# EAGLE design chariot-elevateur (EAGLE 9.2.2)

## Sheet 1 of 2
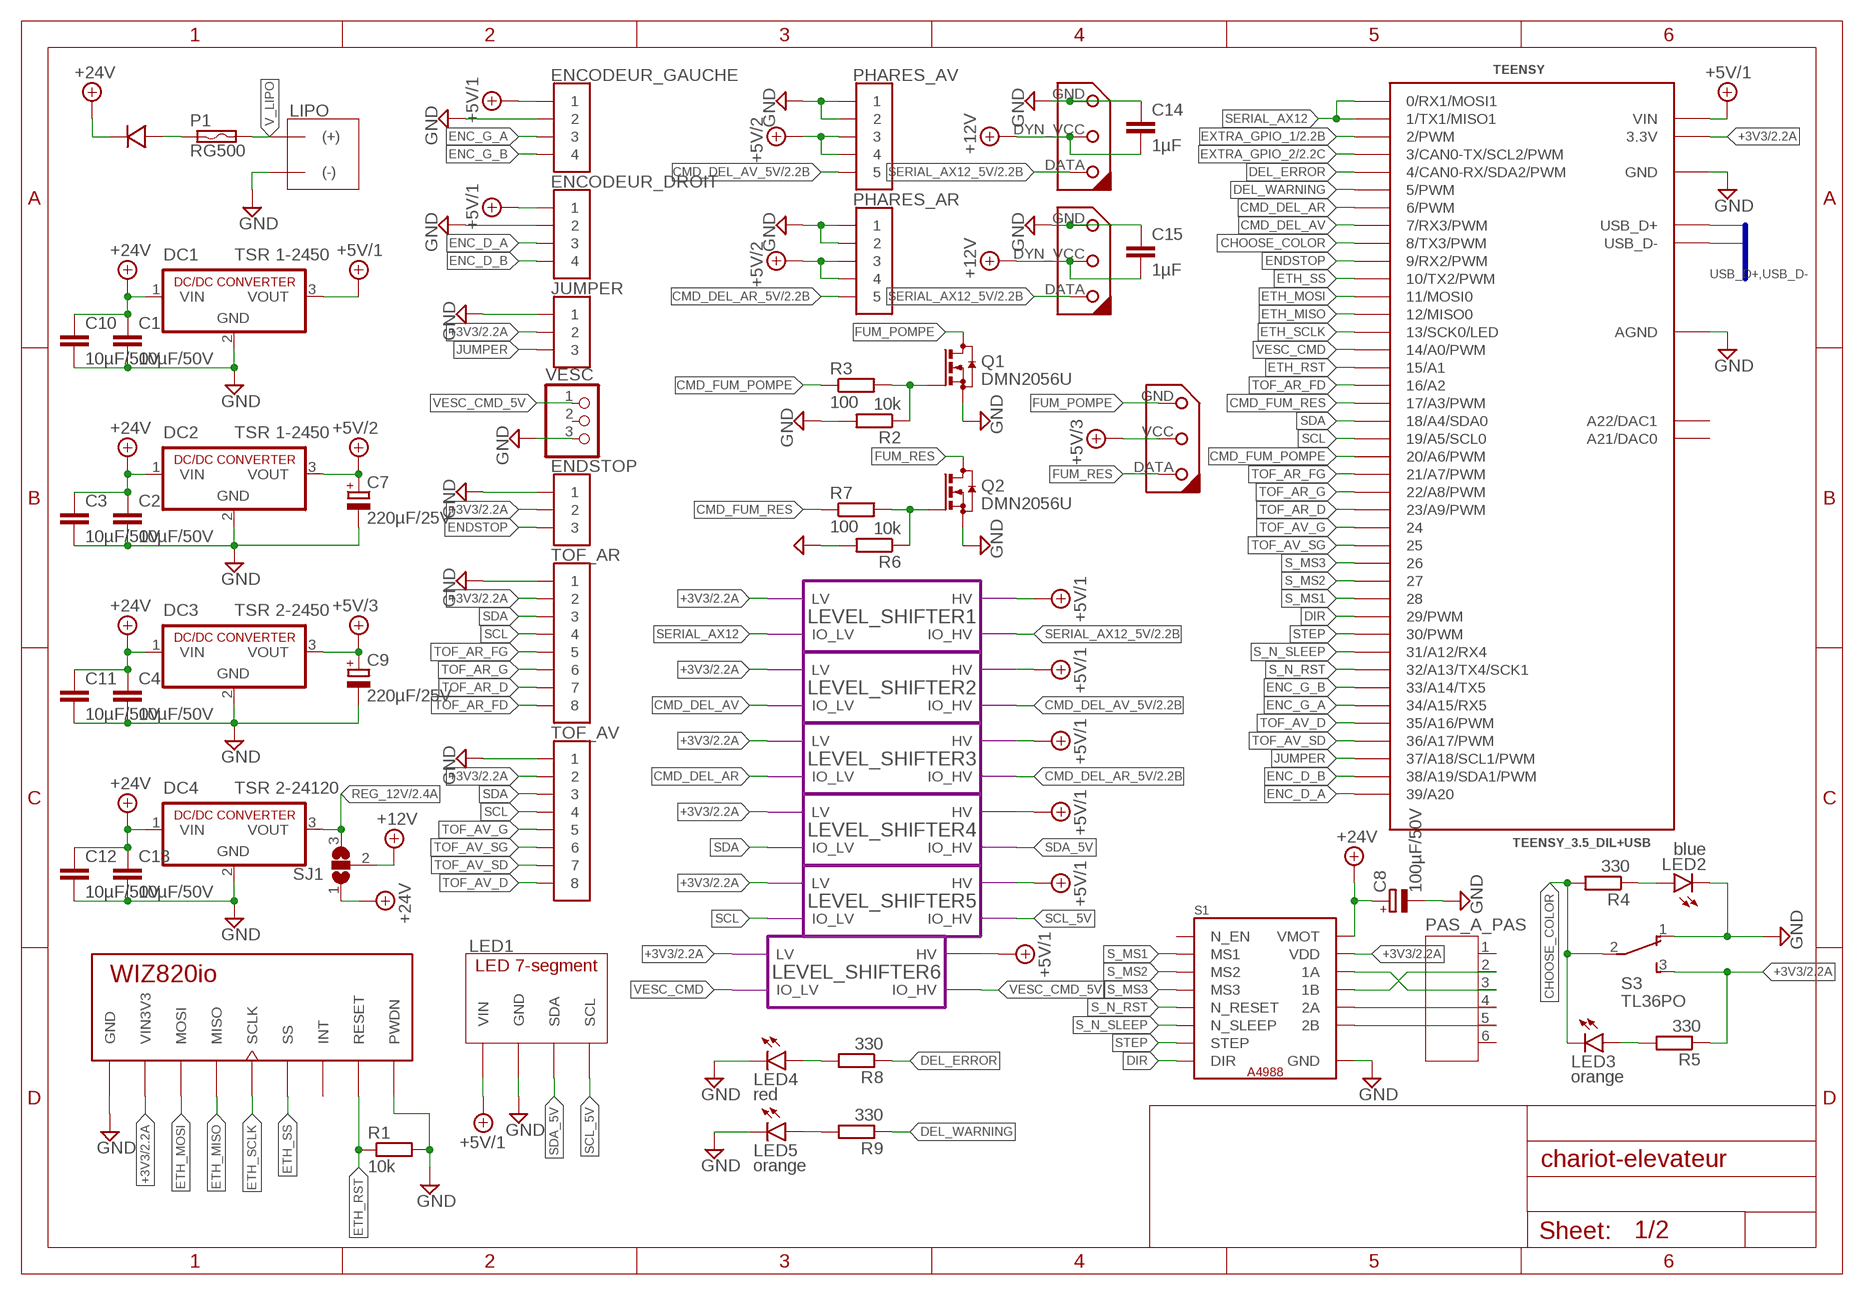
[diagram p0: schematic, sheet 1]

### Parts
AX12_AR  DYNAMIXEL-1X03AX  [DYNAMIXEL_AX_1X03]
AX12_AV  DYNAMIXEL-1X03AX  [DYNAMIXEL_AX_1X03]
C1  10µF/50V  C-EUC1210  [C1210]
C2  10µF/50V  C-EUC1210  [C1210]
C3  10µF/50V  C-EUC1210  [C1210]
C4  10µF/50V  C-EUC1210  [C1210]
C7  220µF/25V  CPOL-EUE3.5-8  [E3,5-8]
C8  100µF/50V  CPOL-EUE3.5-8  [E3,5-8]
C9  220µF/25V  CPOL-EUE3.5-8  [E3,5-8]
C10  10µF/50V  C-EUC1210  [C1210]
C11  10µF/50V  C-EUC1210  [C1210]
C12  10µF/50V  C-EUC1210  [C1210]
C13  10µF/50V  C-EUC1210  [C1210]
C14  1µF  C-EUC0805  [C0805]
C15  1µF  C-EUC0805  [C0805]
D1  DIODE_S15P45  [TO-277A]
DC1  TSR 1-2450  R-78C5.0-1.0  [SIP3]
DC2  TSR 1-2450  R-78C5.0-1.0  [SIP3]
DC3  TSR 2-2450  R-78C5.0-1.0  [SIP3]
DC4  TSR 2-24120  R-78C12-1.0  [SIP3]
ENCODEUR_DROIT  JST-04GH-V  [GH-04-V]
ENCODEUR_GAUCHE  JST-04GH-V  [GH-04-V]
ENDSTOP  JST-03  [GH-03-V]
FUMIGENE  DYNAMIXEL-1X03XL  [DYNAMIXEL_XL_1X03]
JUMPER  JST-03  [GH-03-V]
LED1  ADAFRUIT_7-SEGMENT-LED  [0.56"LED_BACKPACK]
LED2  blue  LEDSMT1206  [1206]
LED3  orange  LEDSMT1206  [1206]
LED4  red  LED3MM  [LED3MM]
LED5  orange  LED3MM  [LED3MM]
LIPO  XT-60  [XT-60]
P1  RG500  RGEF800  [5MM]
PAS_A_PAS  JST-PH6  [JST-PH6]
PHARES_AR  JST-05  [GH-05-V]
PHARES_AV  JST-05  [GH-05-V]
Q1  DMN2056U  BSS123  [SOT23]
Q2  DMN2056U  BSS123  [SOT23]
R1  10k  R-EU_R0805  [R0805]
R2  10k  R-EU_R0805  [R0805]
R3  100  R-EU_R0805  [R0805]
R4  330  R-EU_R0805  [R0805]
R5  330  R-EU_R0805  [R0805]
R6  10k  R-EU_R0805  [R0805]
R7  100  R-EU_R0805  [R0805]
R8  330  R-EU_R0805  [R0805]
R9  330  R-EU_R0805  [R0805]
S1  A4988-BREAKOUT  [A4988-BREAKOUT]
S3  TL36PO  [TL3XPO]
SJ1  SJ2W  [SJ_2]
TEENSY  TEENSY_3.5_DIL+USB  [TEENSY_3.5_DIL+USB]
TOF_AR  JST-08  [GH-08-V]
TOF_AV  JST-08  [GH-08-V]
U1  WIZ820IO  [WIZ820]
VESC  PINHD-1X3/90  [1X03/90]

### Module instances
LEVEL_SHIFTER1 = LEVEL_SHIFTER
LEVEL_SHIFTER2 = LEVEL_SHIFTER
LEVEL_SHIFTER3 = LEVEL_SHIFTER
LEVEL_SHIFTER4 = LEVEL_SHIFTER
LEVEL_SHIFTER5 = LEVEL_SHIFTER
LEVEL_SHIFTER6 = LEVEL_SHIFTER

### Nets
+3V3 [1A]: ENDSTOP.2 JUMPER.2 R5.1 S1.VDD S3.3(S) TEENSY.3.3V TEENSY.3.3V3(3.3V) TOF_AR.2 TOF_AV.2 U1.VIN1(VIN3V3) U1.VIN2(VIN3V3) ; port LEVEL_SHIFTER1.LV LEVEL_SHIFTER2.LV LEVEL_SHIFTER3.LV LEVEL_SHIFTER4.LV LEVEL_SHIFTER5.LV LEVEL_SHIFTER6.LV ; also sheet 2
+5V/1 [1A]: DC1.3(VOUT) ENCODEUR_DROIT.1 ENCODEUR_GAUCHE.1 LED1.VCC(VIN) TEENSY.VIN ; port LEVEL_SHIFTER1.HV LEVEL_SHIFTER4.HV LEVEL_SHIFTER5.HV LEVEL_SHIFTER6.HV LEVEL_SHIFTER2.HV LEVEL_SHIFTER3.HV ; also sheet 2
+5V/2 [2A]: C7.+ DC2.3(VOUT) PHARES_AR.3 PHARES_AR.4 PHARES_AV.3 PHARES_AV.4 ; also sheet 2
+5V/3 [2A]: C9.+ DC3.3(VOUT) FUMIGENE.VCC(DYN_VCC) ; also sheet 2
+12V [2A]: AX12_AR.DYN_VCC AX12_AV.DYN_VCC C14.2 C15.2 SJ1.2 ; also sheet 2
+24V [1A]: C1.1 C2.1 C3.1 C4.1 C8.+ C10.1 C11.1 C12.1 C13.1 D1.- DC1.1(VIN) DC2.1(VIN) DC3.1(VIN) DC4.1(VIN) S1.VMOT SJ1.1 ; also sheet 2
CHOOSE_COLOR: LED3.C R4.2 S3.2(P) TEENSY.8(8/TX3/PWM)
CMD_DEL_AR: TEENSY.6(6/PWM) ; port LEVEL_SHIFTER3.IO_LV
CMD_DEL_AR_5V: PHARES_AR.5 ; port LEVEL_SHIFTER3.IO_HV ; also sheet 2
CMD_DEL_AV: TEENSY.7(7/RX3/PWM) ; port LEVEL_SHIFTER2.IO_LV
CMD_DEL_AV_5V: PHARES_AV.5 ; port LEVEL_SHIFTER2.IO_HV ; also sheet 2
CMD_FUM_POMPE: R3.1 TEENSY.20/A6(20/A6/PWM)
CMD_FUM_RES: R7.1 TEENSY.17/A3(17/A3/PWM)
DEL_ERROR: R8.1 TEENSY.4(4/CAN0-RX/SDA2/PWM)
DEL_WARNING: R9.1 TEENSY.5(5/PWM)
DIR: S1.DIR TEENSY.29(29/PWM)
ENC_D_A: ENCODEUR_DROIT.3 TEENSY.39/A20
ENC_D_B: ENCODEUR_DROIT.4 TEENSY.38/A19(38/A19/SDA1/PWM)
ENC_G_A: ENCODEUR_GAUCHE.3 TEENSY.34/A15(34/A15/RX5)
ENC_G_B: ENCODEUR_GAUCHE.4 TEENSY.33/A14(33/A14/TX5)
ENDSTOP: ENDSTOP.3 TEENSY.9(9/RX2/PWM)
ETH_MISO: TEENSY.12(12/MISO0) U1.MISO
ETH_MOSI: TEENSY.11(11/MOSI0) U1.MOSI
ETH_RST: R1.1 TEENSY.15/A1 U1.RESET
ETH_SCLK: TEENSY.13(13/SCK0/LED) U1.SCLK
ETH_SS: TEENSY.10(10/TX2/PWM) U1.SS
EXTRA_GPIO_1: TEENSY.2(2/PWM) ; also sheet 2
EXTRA_GPIO_2: TEENSY.3(3/CAN0-TX/SCL2/PWM) ; also sheet 2
FUM_POMPE [2A]: FUMIGENE.GND Q1.3(D)
FUM_RES [2A]: FUMIGENE.DATA Q2.3(D)
GND: AX12_AR.GND AX12_AV.GND C1.2 C2.2 C3.2 C4.2 C7.- C8.- C9.- C10.2 C11.2 C12.2 C13.2 C14.1 C15.1 DC1.2(GND) DC2.2(GND) DC3.2(GND) DC4.2(GND) ENCODEUR_DROIT.2 ENCODEUR_GAUCHE.2 ENDSTOP.1 JUMPER.1 LED1.GND LED2.C LED4.K(C) LED5.K(C) LIPO.(-) PHARES_AR.1 PHARES_AR.2 PHARES_AV.1 PHARES_AV.2 Q1.2(S) Q2.2(S) R1.2 R2.2 R6.2 S1.GND1(GND) S1.GND2(GND) S3.1(O) TEENSY.AGND TEENSY.GND TEENSY.GND1(GND) TOF_AR.1 TOF_AV.1 U1.GND1(GND) U1.GND2(GND) U1.GND3(GND) U1.PWDN VESC.3 ; also sheet 2
JUMPER: JUMPER.3 TEENSY.37/A18(37/A18/SCL1/PWM)
N$1: LED4.A R8.2
N$2 [2A]: PAS_A_PAS.2 S1.1B
N$3 [2A]: PAS_A_PAS.3 S1.1A
N$4: D1.+1(+) D1.+2(+) P1.P$1
N$5 [2A]: PAS_A_PAS.4 S1.2A
N$6 [2A]: PAS_A_PAS.5 S1.2B
N$7: LED2.A R4.1
N$8: LED3.A R5.2
N$10: Q1.1(G) R2.1 R3.2
N$11: LED5.A R9.2
N$13: Q2.1(G) R6.1 R7.2
REG_12V [2A]: DC4.3(VOUT) SJ1.3 ; also sheet 2
S_MS1: S1.MS1 TEENSY.28
S_MS2: S1.MS2 TEENSY.27
S_MS3: S1.MS3 TEENSY.26
S_N_RST: S1.N_RST(N_RESET) TEENSY.32/A13(32/A13/TX4/SCK1)
S_N_SLEEP: S1.N_SLEEP TEENSY.31/A12(31/A12/RX4)
SCL: TEENSY.19/A5(19/A5/SCL0) TOF_AR.4 TOF_AV.4 ; port LEVEL_SHIFTER5.IO_LV
SCL_5V: LED1.SCL ; port LEVEL_SHIFTER5.IO_HV
SDA: TEENSY.18/A4(18/A4/SDA0) TOF_AR.3 TOF_AV.3 ; port LEVEL_SHIFTER4.IO_LV
SDA_5V: LED1.SDA ; port LEVEL_SHIFTER4.IO_HV
SERIAL_AX12: TEENSY.0(0/RX1/MOSI1) TEENSY.1(1/TX1/MISO1) ; port LEVEL_SHIFTER1.IO_LV
SERIAL_AX12_5V: AX12_AR.DATA AX12_AV.DATA ; port LEVEL_SHIFTER1.IO_HV ; also sheet 2
STEP: S1.STEP TEENSY.30(30/PWM)
TOF_AR_D: TEENSY.23/A9(23/A9/PWM) TOF_AR.7
TOF_AR_FD: TEENSY.16/A2 TOF_AR.8
TOF_AR_FG: TEENSY.21/A7(21/A7/PWM) TOF_AR.5
TOF_AR_G: TEENSY.22/A8(22/A8/PWM) TOF_AR.6
TOF_AV_D: TEENSY.35/A16(35/A16/PWM) TOF_AV.8
TOF_AV_G: TEENSY.24 TOF_AV.5
TOF_AV_SD: TEENSY.36/A17(36/A17/PWM) TOF_AV.7
TOF_AV_SG: TEENSY.25 TOF_AV.6
USB_D+: TEENSY.USBD+(USB_D+) ; also sheet 2
USB_D-: TEENSY.USBD-(USB_D-) ; also sheet 2
V_LIPO [5A]: LIPO.(+) P1.P$2
VESC_CMD: TEENSY.14/A0(14/A0/PWM) ; port LEVEL_SHIFTER6.IO_LV
VESC_CMD_5V: VESC.1 ; port LEVEL_SHIFTER6.IO_HV
Unconnected: PAS_A_PAS.1 PAS_A_PAS.6 S1.N_EN TEENSY.A21(A21/DAC0) TEENSY.A22(A22/DAC1) U1.INT VESC.2

### Buses
USB_D+,USB_D-

## Sheet 2 of 2
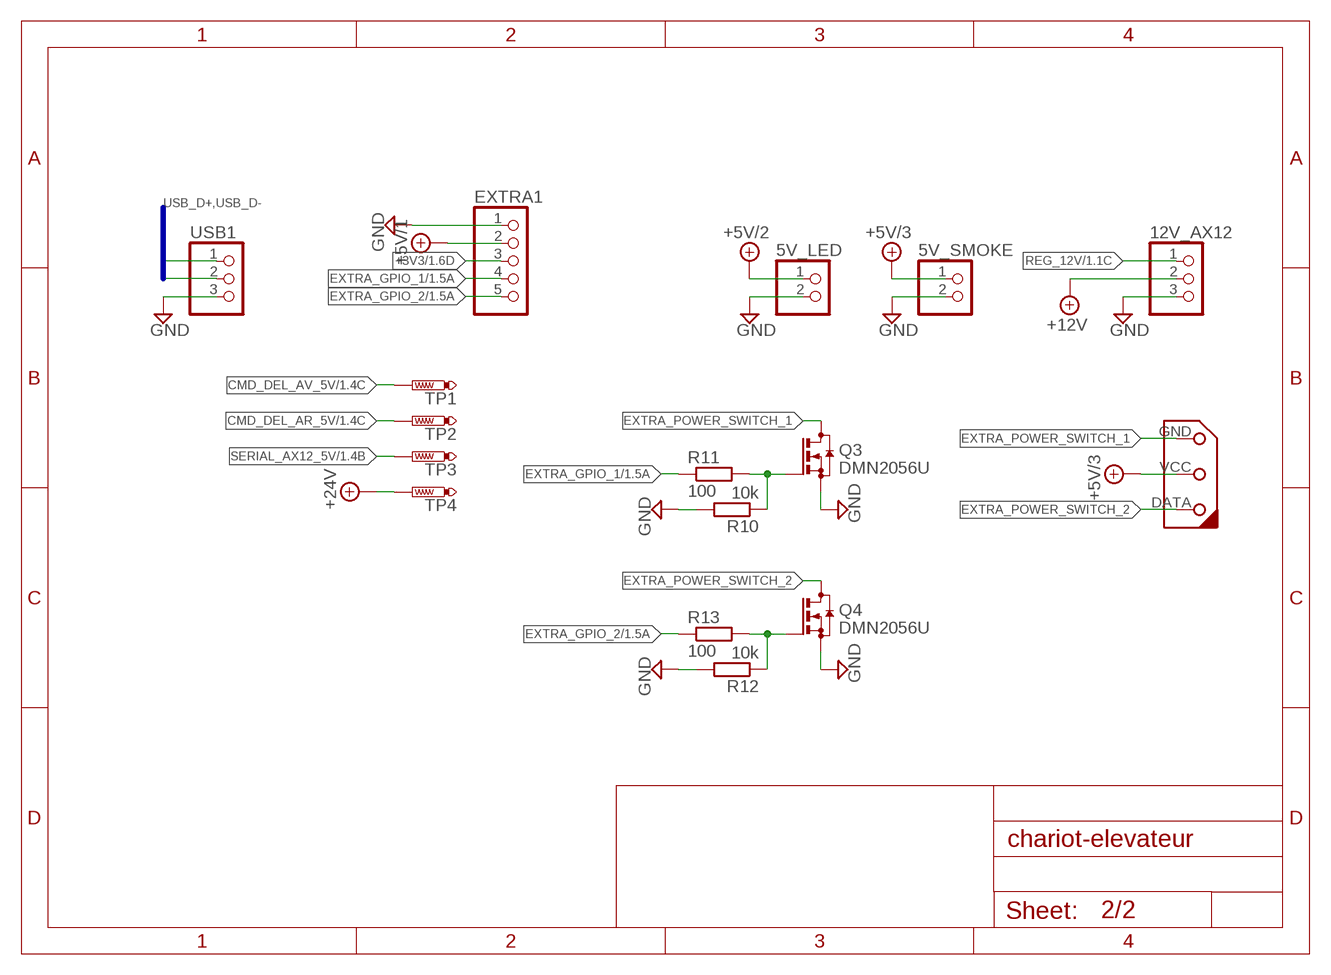
[diagram p1: schematic, sheet 2]

### Parts
5V_LED  PINHD-1X2  [1X02]
5V_SMOKE  PINHD-1X2  [1X02]
12V_AX12  PINHD-1X3  [1X03]
EXTRA  DYNAMIXEL-1X03XL  [DYNAMIXEL_XL_1X03]
EXTRA1  PINHD-1X5  [1X05]
Q3  DMN2056U  BSS123  [SOT23]
Q4  DMN2056U  BSS123  [SOT23]
R10  10k  R-EU_R0805  [R0805]
R11  100  R-EU_R0805  [R0805]
R12  10k  R-EU_R0805  [R0805]
R13  100  R-EU_R0805  [R0805]
TP1  PTR1PAD1-13  [P1-13]
TP2  PTR1PAD1-13  [P1-13]
TP3  PTR1PAD1-13  [P1-13]
TP4  PTR1PAD1-13  [P1-13]
USB1  PINHD-1X3  [1X03]

### Nets
+3V3 [1A]: EXTRA1.3 ; also sheet 1
+5V/1 [1A]: EXTRA1.2 ; also sheet 1
+5V/2 [2A]: 5V_LED.1 ; also sheet 1
+5V/3 [2A]: 5V_SMOKE.1 EXTRA.VCC(DYN_VCC) ; also sheet 1
+12V [2A]: 12V_AX12.2 ; also sheet 1
+24V [1A]: TP4.TP ; also sheet 1
CMD_DEL_AR_5V: TP2.TP ; also sheet 1
CMD_DEL_AV_5V: TP1.TP ; also sheet 1
EXTRA_GPIO_1: EXTRA1.4 R11.1 ; also sheet 1
EXTRA_GPIO_2: EXTRA1.5 R13.1 ; also sheet 1
EXTRA_POWER_SWITCH_1 [2A]: EXTRA.GND Q3.3(D)
EXTRA_POWER_SWITCH_2 [2A]: EXTRA.DATA Q4.3(D)
GND: 5V_LED.2 5V_SMOKE.2 12V_AX12.3 EXTRA1.1 Q3.2(S) Q4.2(S) R10.2 R12.2 USB1.3 ; also sheet 1
N$9: Q3.1(G) R10.1 R11.2
N$12: Q4.1(G) R12.1 R13.2
REG_12V [2A]: 12V_AX12.1 ; also sheet 1
SERIAL_AX12_5V: TP3.TP ; also sheet 1
USB_D+: USB1.1 ; also sheet 1
USB_D-: USB1.2 ; also sheet 1

### Buses
USB_D+,USB_D-

## Library data of the parts
5V_LED 5V_SMOKE = pinhead:PINHD-1X2: PIN HEADER
12V_AX12 USB1 VESC = pinhead:PINHD-1X3: PIN HEADER
AX12_AR AX12_AV = 1NTech_pinhead:DYNAMIXEL-1X03; RS: 687-8124; RS_AX: 687-8124; RS_XL: 688-3283
C1-C4 C10-C15 = resistor:C-EU: CAPACITOR, European symbol
C7-C9 = resistor:CPOL-EU: POLARIZED CAPACITOR, European symbol
D1 = diode_schottky:DIODE_S15P45; RS: 917-9118
DC1 DC2 = dc-dc-converter:R-78C*-1.0: INNOLINE DC/DC-Converter 1.0 AMP SIP3 Single Output Source: Data sheet <http://www.mikrocontroller.net/attachment/150645/157764-da-01-en-DC_DC_WANDLER_R_78C5_0_1_0.pdf>; RS: 666-4379
DC3 = dc-dc-converter:R-78C*-1.0: INNOLINE DC/DC-Converter 1.0 AMP SIP3 Single Output Source: Data sheet <http://www.mikrocontroller.net/attachment/150645/157764-da-01-en-DC_DC_WANDLER_R_78C5_0_1_0.pdf>; RS: 906-8487
DC4 = dc-dc-converter:R-78C*-1.0: INNOLINE DC/DC-Converter 1.0 AMP SIP3 Single Output Source: Data sheet <http://www.mikrocontroller.net/attachment/150645/157764-da-01-en-DC_DC_WANDLER_R_78C5_0_1_0.pdf>; RS: 906-8493
ENCODEUR_DROIT ENCODEUR_GAUCHE = con-jst:JST-04; RS: 752-1769; RS_F: 752-1731
ENDSTOP JUMPER = con-jst:JST-03; RS: 752-1765; RS_F: 752-1737
EXTRA FUMIGENE = 1NTech_pinhead:DYNAMIXEL-1X03; RS: 688-3283
EXTRA1 = pinhead:PINHD-1X5: PIN HEADER
LED1 = Adafruit-7-segment:ADAFRUIT_7-SEGMENT-LED; ADAFRUIT: 879
LED2 = led:LED: LED OSRAM: - CHIPLED LG R971, LG N971, LY N971, LG Q971, LY Q971, LO R971, LY R971 LH N974, LH R974 LS Q976, LO Q976, LY Q976 LO Q996 - Hyper CHIPLED LW Q18S LB Q993, LB Q99A, LB R99A - SideLED LS A670, LO A670, LY A670, LG A670, LP A670 LB A673, LV A673, LT A673, LW A673 LH A674 LY A675 LS A676, LA A676, LO A676, LY A676, LW A676 LS A679, LY A679, LG A679 - Hyper Micro SIDELED® LS Y876, LA Y876, LO Y876, LY Y876 LT Y87S - SmartLED LW L88C, LW L88S LB L89C, LB L89S, LG L890 LS L89K, LO L89K, LY L89K LS L896, LA L896, LO L896, LY L896 - TOPLED LS T670, LO T670, LY T670, LG T670, LP T670 LSG T670, LSP T670, LSY T670, LOP T670, LYG T670 LG T671, LOG T671, LSG T671 LB T673, LV T673, LT T673, LW T673 LH T674 LS T676, LA T676, LO T676, LY T676, LB T676, LH T676, LSB T676, LW T676 LB T67C, LV T67C, LT T67C, LS T67K, LO T67K, LY T67K, LW E67C LS E67B, LA E67B, LO E67B, LY E67B, LB E67C, LV E67C, LT E67C LW T67C LS T679, LY T679, LG T679 LS T770, LO T770, LY T770, LG T770, LP T770 LB T773, LV T773, LT T773, LW T773 LH T774 LS E675, LA E675, LY E675, LS T675 LS T776, LA T776, LO T776, LY T776, LB T776 LHGB T686 LT T68C, LB T68C - Hyper Mini TOPLED® LB M676 - Mini TOPLED Santana® LG M470 LS M47K, LO M47K, LY M47K Source: http://www.osram.convergy.de LUXEON: - LUMILED® LXK2-PW12-R00, LXK2-PW12-S00, LXK2-PW14-U00, LXK2-PW14-V00 LXK2-PM12-R00, LXK2-PM12-S00, LXK2-PM14-U00 LXK2-PE12-Q00, LXK2-PE12-R00, LXK2-PE12-S00, LXK2-PE14-T00, LXK2-PE14-U00 LXK2-PB12-K00, LXK2-PB12-L00, LXK2-PB12-M00, LXK2-PB14-N00, LXK2-PB14-P00, LXK2-PB14-Q00 LXK2-PR12-L00, LXK2-PR12-M00, LXK2-PR14-Q00, LXK2-PR14-R00 LXK2-PD12-Q00, LXK2-PD12-R00, LXK2-PD12-S00 LXK2-PH12-R00, LXK2-PH12-S00 LXK2-PL12-P00, LXK2-PL12-Q00, LXK2-PL12-R00 Source: www.luxeon.com KINGBRIGHT: KA-3528ASYC Source: www.kingbright.com; RS: 692-1073
LED3 = led:LED: LED OSRAM: - CHIPLED LG R971, LG N971, LY N971, LG Q971, LY Q971, LO R971, LY R971 LH N974, LH R974 LS Q976, LO Q976, LY Q976 LO Q996 - Hyper CHIPLED LW Q18S LB Q993, LB Q99A, LB R99A - SideLED LS A670, LO A670, LY A670, LG A670, LP A670 LB A673, LV A673, LT A673, LW A673 LH A674 LY A675 LS A676, LA A676, LO A676, LY A676, LW A676 LS A679, LY A679, LG A679 - Hyper Micro SIDELED® LS Y876, LA Y876, LO Y876, LY Y876 LT Y87S - SmartLED LW L88C, LW L88S LB L89C, LB L89S, LG L890 LS L89K, LO L89K, LY L89K LS L896, LA L896, LO L896, LY L896 - TOPLED LS T670, LO T670, LY T670, LG T670, LP T670 LSG T670, LSP T670, LSY T670, LOP T670, LYG T670 LG T671, LOG T671, LSG T671 LB T673, LV T673, LT T673, LW T673 LH T674 LS T676, LA T676, LO T676, LY T676, LB T676, LH T676, LSB T676, LW T676 LB T67C, LV T67C, LT T67C, LS T67K, LO T67K, LY T67K, LW E67C LS E67B, LA E67B, LO E67B, LY E67B, LB E67C, LV E67C, LT E67C LW T67C LS T679, LY T679, LG T679 LS T770, LO T770, LY T770, LG T770, LP T770 LB T773, LV T773, LT T773, LW T773 LH T774 LS E675, LA E675, LY E675, LS T675 LS T776, LA T776, LO T776, LY T776, LB T776 LHGB T686 LT T68C, LB T68C - Hyper Mini TOPLED® LB M676 - Mini TOPLED Santana® LG M470 LS M47K, LO M47K, LY M47K Source: http://www.osram.convergy.de LUXEON: - LUMILED® LXK2-PW12-R00, LXK2-PW12-S00, LXK2-PW14-U00, LXK2-PW14-V00 LXK2-PM12-R00, LXK2-PM12-S00, LXK2-PM14-U00 LXK2-PE12-Q00, LXK2-PE12-R00, LXK2-PE12-S00, LXK2-PE14-T00, LXK2-PE14-U00 LXK2-PB12-K00, LXK2-PB12-L00, LXK2-PB12-M00, LXK2-PB14-N00, LXK2-PB14-P00, LXK2-PB14-Q00 LXK2-PR12-L00, LXK2-PR12-M00, LXK2-PR14-Q00, LXK2-PR14-R00 LXK2-PD12-Q00, LXK2-PD12-R00, LXK2-PD12-S00 LXK2-PH12-R00, LXK2-PH12-S00 LXK2-PL12-P00, LXK2-PL12-Q00, LXK2-PL12-R00 Source: www.luxeon.com KINGBRIGHT: KA-3528ASYC Source: www.kingbright.com; RS: 726-9215
LED4 = led:LED: LED OSRAM: - CHIPLED LG R971, LG N971, LY N971, LG Q971, LY Q971, LO R971, LY R971 LH N974, LH R974 LS Q976, LO Q976, LY Q976 LO Q996 - Hyper CHIPLED LW Q18S LB Q993, LB Q99A, LB R99A - SideLED LS A670, LO A670, LY A670, LG A670, LP A670 LB A673, LV A673, LT A673, LW A673 LH A674 LY A675 LS A676, LA A676, LO A676, LY A676, LW A676 LS A679, LY A679, LG A679 - Hyper Micro SIDELED® LS Y876, LA Y876, LO Y876, LY Y876 LT Y87S - SmartLED LW L88C, LW L88S LB L89C, LB L89S, LG L890 LS L89K, LO L89K, LY L89K LS L896, LA L896, LO L896, LY L896 - TOPLED LS T670, LO T670, LY T670, LG T670, LP T670 LSG T670, LSP T670, LSY T670, LOP T670, LYG T670 LG T671, LOG T671, LSG T671 LB T673, LV T673, LT T673, LW T673 LH T674 LS T676, LA T676, LO T676, LY T676, LB T676, LH T676, LSB T676, LW T676 LB T67C, LV T67C, LT T67C, LS T67K, LO T67K, LY T67K, LW E67C LS E67B, LA E67B, LO E67B, LY E67B, LB E67C, LV E67C, LT E67C LW T67C LS T679, LY T679, LG T679 LS T770, LO T770, LY T770, LG T770, LP T770 LB T773, LV T773, LT T773, LW T773 LH T774 LS E675, LA E675, LY E675, LS T675 LS T776, LA T776, LO T776, LY T776, LB T776 LHGB T686 LT T68C, LB T68C - Hyper Mini TOPLED® LB M676 - Mini TOPLED Santana® LG M470 LS M47K, LO M47K, LY M47K Source: http://www.osram.convergy.de LUXEON: - LUMILED® LXK2-PW12-R00, LXK2-PW12-S00, LXK2-PW14-U00, LXK2-PW14-V00 LXK2-PM12-R00, LXK2-PM12-S00, LXK2-PM14-U00 LXK2-PE12-Q00, LXK2-PE12-R00, LXK2-PE12-S00, LXK2-PE14-T00, LXK2-PE14-U00 LXK2-PB12-K00, LXK2-PB12-L00, LXK2-PB12-M00, LXK2-PB14-N00, LXK2-PB14-P00, LXK2-PB14-Q00 LXK2-PR12-L00, LXK2-PR12-M00, LXK2-PR14-Q00, LXK2-PR14-R00 LXK2-PD12-Q00, LXK2-PD12-R00, LXK2-PD12-S00 LXK2-PH12-R00, LXK2-PH12-S00 LXK2-PL12-P00, LXK2-PL12-Q00, LXK2-PL12-R00 Source: www.luxeon.com KINGBRIGHT: KA-3528ASYC Source: www.kingbright.com; RS: 619-4886
LED5 = led:LED: LED OSRAM: - CHIPLED LG R971, LG N971, LY N971, LG Q971, LY Q971, LO R971, LY R971 LH N974, LH R974 LS Q976, LO Q976, LY Q976 LO Q996 - Hyper CHIPLED LW Q18S LB Q993, LB Q99A, LB R99A - SideLED LS A670, LO A670, LY A670, LG A670, LP A670 LB A673, LV A673, LT A673, LW A673 LH A674 LY A675 LS A676, LA A676, LO A676, LY A676, LW A676 LS A679, LY A679, LG A679 - Hyper Micro SIDELED® LS Y876, LA Y876, LO Y876, LY Y876 LT Y87S - SmartLED LW L88C, LW L88S LB L89C, LB L89S, LG L890 LS L89K, LO L89K, LY L89K LS L896, LA L896, LO L896, LY L896 - TOPLED LS T670, LO T670, LY T670, LG T670, LP T670 LSG T670, LSP T670, LSY T670, LOP T670, LYG T670 LG T671, LOG T671, LSG T671 LB T673, LV T673, LT T673, LW T673 LH T674 LS T676, LA T676, LO T676, LY T676, LB T676, LH T676, LSB T676, LW T676 LB T67C, LV T67C, LT T67C, LS T67K, LO T67K, LY T67K, LW E67C LS E67B, LA E67B, LO E67B, LY E67B, LB E67C, LV E67C, LT E67C LW T67C LS T679, LY T679, LG T679 LS T770, LO T770, LY T770, LG T770, LP T770 LB T773, LV T773, LT T773, LW T773 LH T774 LS E675, LA E675, LY E675, LS T675 LS T776, LA T776, LO T776, LY T776, LB T776 LHGB T686 LT T68C, LB T68C - Hyper Mini TOPLED® LB M676 - Mini TOPLED Santana® LG M470 LS M47K, LO M47K, LY M47K Source: http://www.osram.convergy.de LUXEON: - LUMILED® LXK2-PW12-R00, LXK2-PW12-S00, LXK2-PW14-U00, LXK2-PW14-V00 LXK2-PM12-R00, LXK2-PM12-S00, LXK2-PM14-U00 LXK2-PE12-Q00, LXK2-PE12-R00, LXK2-PE12-S00, LXK2-PE14-T00, LXK2-PE14-U00 LXK2-PB12-K00, LXK2-PB12-L00, LXK2-PB12-M00, LXK2-PB14-N00, LXK2-PB14-P00, LXK2-PB14-Q00 LXK2-PR12-L00, LXK2-PR12-M00, LXK2-PR14-Q00, LXK2-PR14-R00 LXK2-PD12-Q00, LXK2-PD12-R00, LXK2-PD12-S00 LXK2-PH12-R00, LXK2-PH12-S00 LXK2-PL12-P00, LXK2-PL12-Q00, LXK2-PL12-R00 Source: www.luxeon.com KINGBRIGHT: KA-3528ASYC Source: www.kingbright.com; RS: 127-8387
LIPO = con-xt:XT-60
P1 = polyswitch:RGEF800; RS: 817-1680
PAS_A_PAS = jst-ph:JST-PH6; RS: 820-1447; RS_F: 820-1481
PHARES_AR PHARES_AV = con-jst:JST-05; RS: 752-1778; RS_F: 752-1740
Q1-Q4 = transistor-small-signal:BSS123: N-CHANNEL MOS FET; RS: 133-3376
R1-R13 = resistor:R-EU_: RESISTOR, European symbol
S1 = stepper:A4988-BREAKOUT
S3 = switch:TL36PO: TINY SWITCH ON - ON Source: http://www2.produktinfo.conrad.com/datenblaetter/700000-724999/705152-da-01-de-Subminiaturschalter_TL_36YO.pdf; RS: 913-9069
SJ1 = jumper:SJ2W: SMD solder JUMPER
TEENSY = Teensy_libSG:TEENSY_3.5_DIL+USB
TOF_AR TOF_AV = con-jst:JST-08; RS: 752-1775; RS_F: 752-1747
TP1-TP4 = testpad:PTR1: TEST PIN
U1 = wiznet:WIZ820IO; RS: 758-1032

## Module LEVEL_SHIFTER
Ports: LV(io) IO_LV(io) HV(io) IO_HV(io)
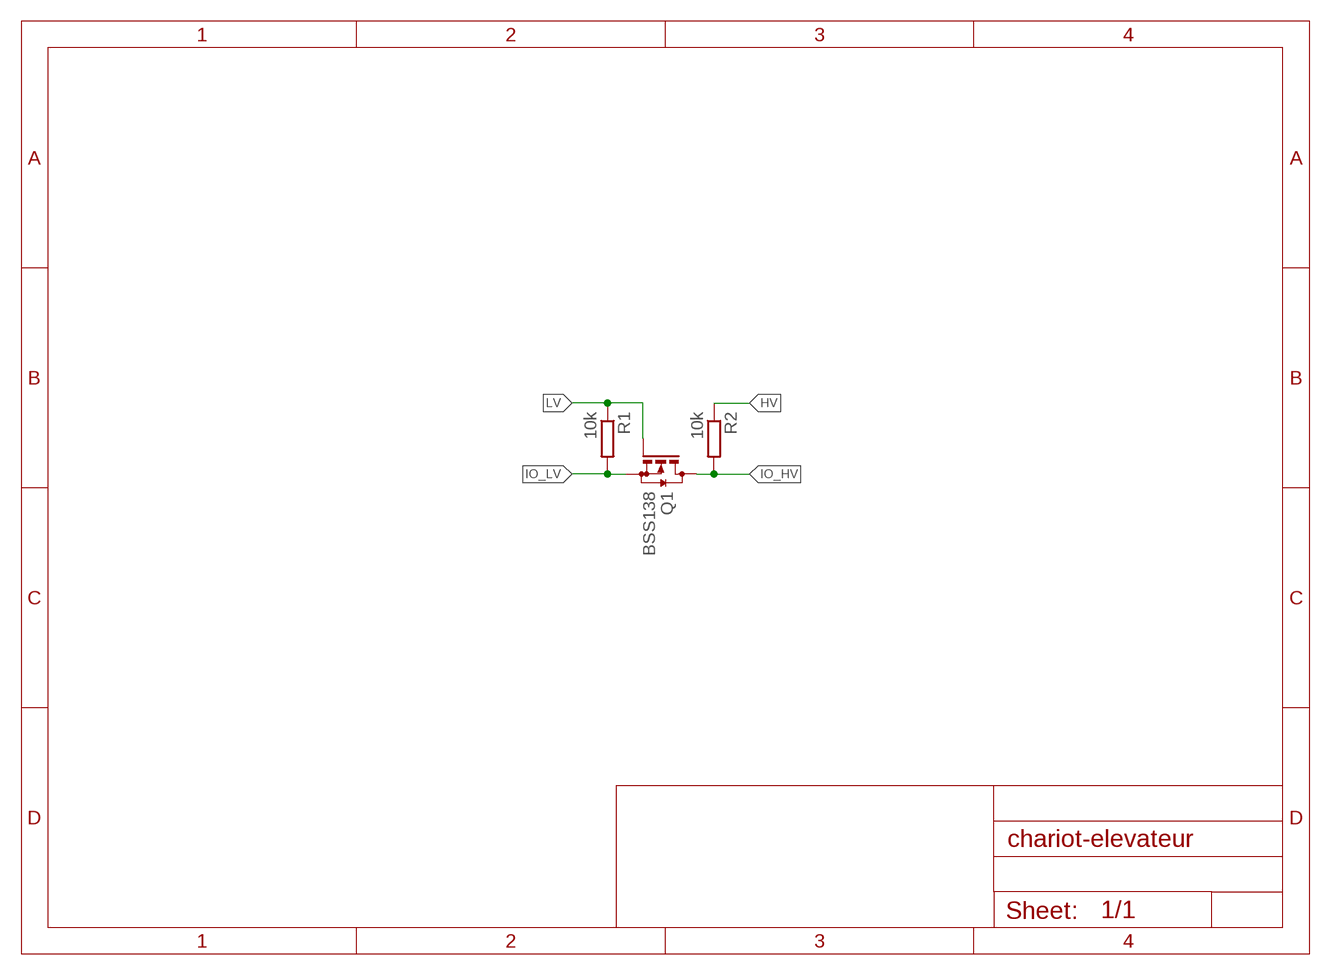
[diagram p2: schematic, module LEVEL_SHIFTER, sheet 1]

### Parts
Q1  BSS138  BSS123  [SOT23]
R1  10k  R-EU_R0805  [R0805]
R2  10k  R-EU_R0805  [R0805]

### Nets
HV: R2.1
IO_HV: Q1.3(D) R2.2
IO_LV: Q1.2(S) R1.2
LV: Q1.1(G) R1.1

### Library data of the parts
Q1 = transistor-small-signal:BSS123: N-CHANNEL MOS FET; RS: 669-7559
R1 R2 = resistor:R-EU_: RESISTOR, European symbol

## Net classes
0 0.7A: width 0.2 mm
1 5A: width 2.8 mm, drill 0.5 mm
2 2A: width 0.8 mm, drill 0.4 mm
3 1A: width 0.3 mm, drill 0.35 mm

## Board
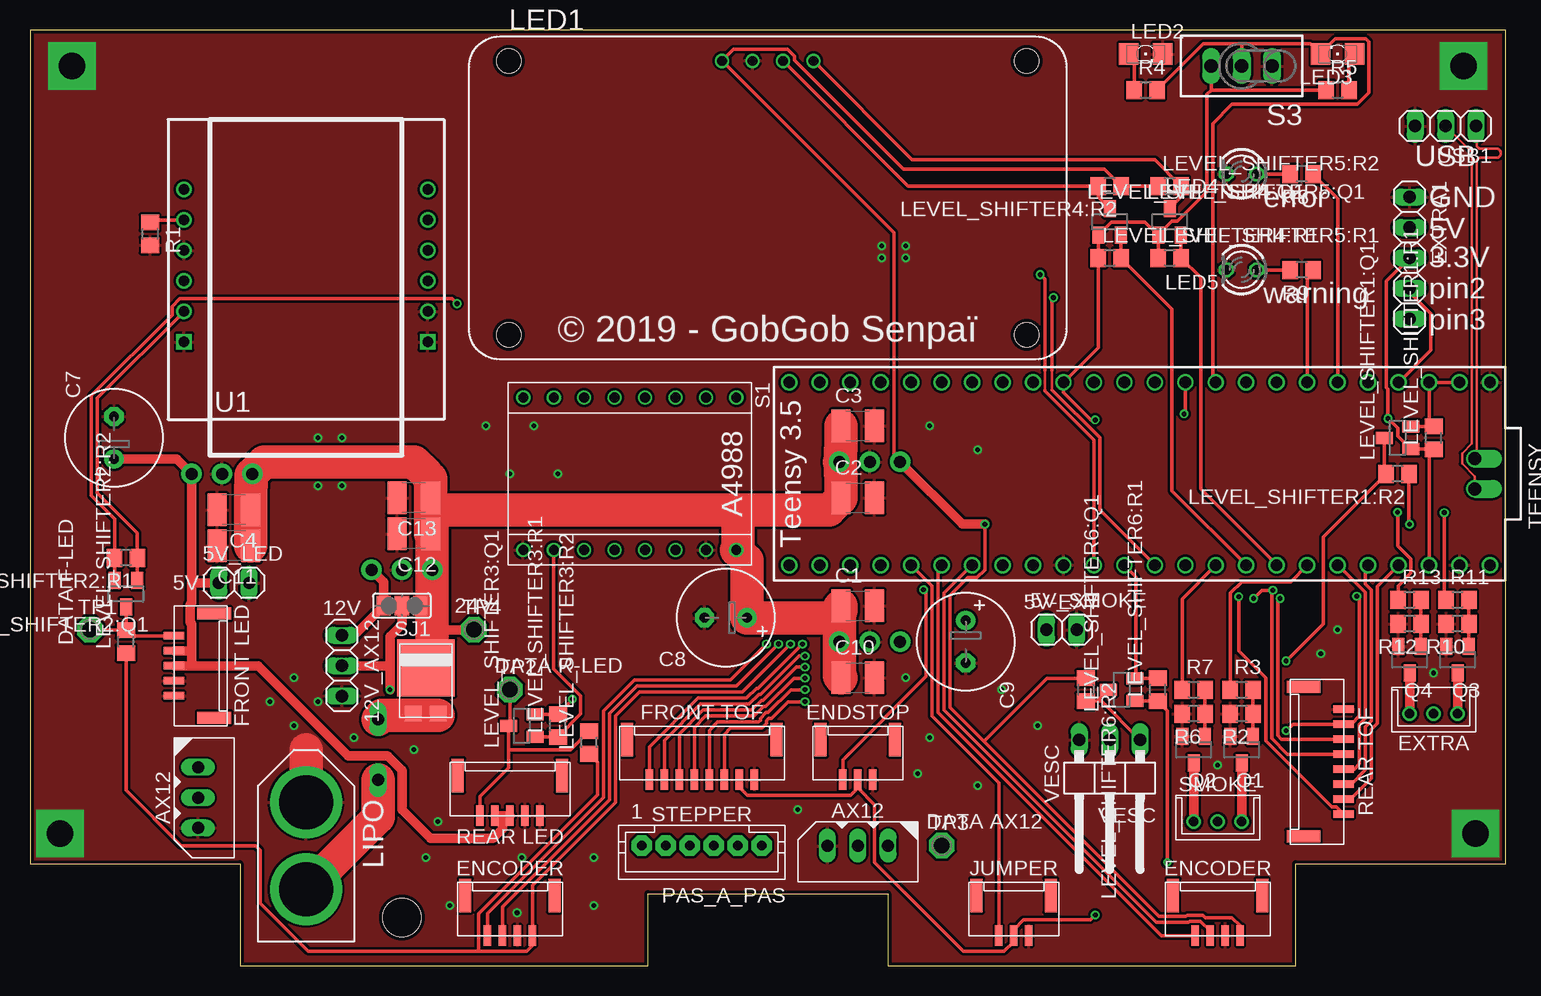
[diagram p3: board, top side]
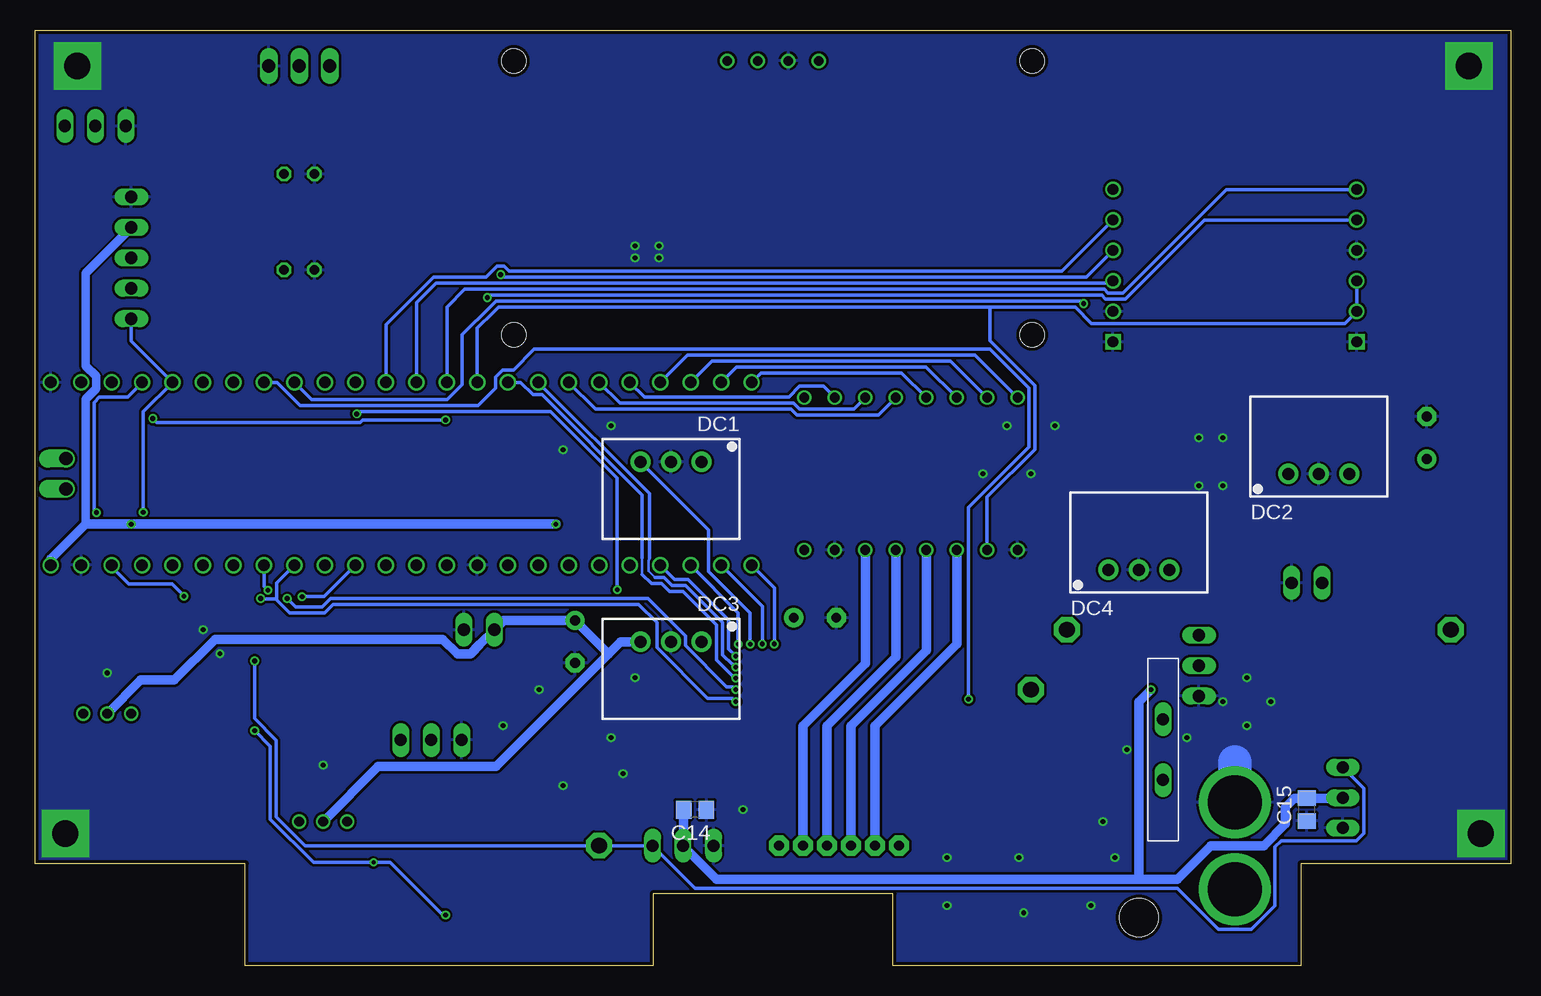
[diagram p4: board, bottom side, seen from below]

Size 123 x 78 mm. Coordinates in mm from the lower left corner, seen from the top.
Outline: 17.5,0 51.5,0 51.5,6 71.5,6 71.5,0 105.5,0 105.5,8.5 123,8.5 123,78 0,78 0,8.5 17.5,8.5 17.5,0
Copper layers (1*16): Top 0.035mm / dielectric 1.5mm / Bottom 0.035mm
Design rules "PCB-POOL Standard *": minimum track width 0.2mm, minimum drill 0.3mm, track to track 0.2mm, track to pad 0.2mm, pad to pad 0.2mm, via to via 0.2mm, smd to smd 0.2mm, copper to edge 0.3mm, drill to drill 0.2mm, minimum pad ring 0.2mm, minimum via ring 0.15mm, stop-mask expansion 0.075mm, vias tented up to drill 0.8mm, thermal gap 0.2mm
Holes 3.2 mm at 31,4
tKeepout: area 28,1 to 34,7; 4 lines
bKeepout: 4 lines

### Footprints (pad centres in the part's own frame; a part is rotated, then mirrored left to right if it is on the bottom)
1X02 = drill 1.016 long: 1 -1.27,0; 2 1.27,0
1X03 = drill 1.016 long: 1 -2.54,0; 2 0,0; 3 2.54,0
DYNAMIXEL_AX_1X03 = drill 1 long: DATA 2.54,0; DYN_VCC 0,0; GND -2.54,0
C1210 = smd 1.6 x 2.7: 1 -1.4,0; 2 1.4,0
E3,5-8 = drill 0.813 pad 1.6: + -1.778,0 | drill 0.813 pad 1.6 octagon: - 1.778,0
C0805 = smd 1.3 x 1.5: 1 -0.95,0; 2 0.95,0
TO-277A = smd 1.4 x 1.27: +1 -1.04,-1; +2 1.04,-1 | smd 4.8 x 4.72: - 0,2.81
SIP3 = drill 1 pad 1.676: 1 -2.54,0; 2 0,0; 3 2.54,0
GH-04-V = smd 0.6 x 1.7: 1 -1.875,2.5; 2 -0.625,2.5; 3 0.625,2.5; 4 1.875,2.5 | smd 1 x 2.8: CASE0 3.725,-0.85; CASE1 -3.725,-0.85
GH-03-V = smd 0.6 x 1.7: 1 -1.25,2.5; 2 0,2.5; 3 1.25,2.5 | smd 1 x 2.8: CASE0 3.1,-0.85; CASE1 -3.1,-0.85
DYNAMIXEL_XL_1X03 = drill 0.8: DATA 2,0; GND -2,0; VCC 0,0
1X05 = drill 1.016 long: 1 -5.08,0; 2 -2.54,0; 3 0,0; 4 2.54,0; 5 5.08,0
0.56"LED_BACKPACK = drill 0.8: GND -1.27,11.43; SCL 3.81,11.43; SDA 1.27,11.43; VCC -3.81,11.43 | hole 2.032: -21.59,11.43; 21.59,11.43; -21.59,-11.43; 21.59,-11.43
1206 = smd 1.6 x 1.803: A -1.422,0; C 1.422,0
LED3MM = drill 0.813 octagon: A -1.27,0; K 1.27,0
SOT23 = smd 1 x 1.4: 1 -0.95,-1.1; 2 0.95,-1.1; 3 0,1.1
R0805 = smd 1.3 x 1.5: 1 -0.95,0; 2 0.95,0
XT-60 = drill 4.5 pad 6: (+) 0,-3.625; (-) 0,3.625
5MM = drill 1 long: P$1 -2.54,0; P$2 2.54,0
JST-PH6 = drill 0.813 pad 1.676 octagon: 1 5,0; 2 3,0; 3 1,0; 4 -1,0; 5 -3,0; 6 -5,0
GH-05-V = smd 0.6 x 1.7: 1 -2.5,2.5; 2 -1.25,2.5; 3 0,2.5; 4 1.25,2.5; 5 2.5,2.5 | smd 1 x 2.8: CASE0 4.35,-0.85; CASE1 -4.35,-0.85
A4988-BREAKOUT = drill 0.8: 1A 6.35,-1.27; 1B 6.35,-3.81; 2A 6.35,1.27; 2B 6.35,3.81; DIR -6.35,-8.89; GND1 6.35,6.35; GND2 6.35,-8.89; MS1 -6.35,6.35; MS2 -6.35,3.81; MS3 -6.35,1.27; N_EN -6.35,8.89; N_RST -6.35,-1.27; N_SLEEP -6.35,-3.81; STEP -6.35,-6.35; VDD 6.35,-6.35; VMOT 6.35,8.89
TL3XPO = drill 1.1 pad 1.422 long: 1 -2.54,0; 2 0,0; 3 2.54,0
SJ_2 = smd 1.168 x 1.6: 1 -1.524,0; 2 0,0; 3 1.524,0
TEENSY_3.5_DIL+USB = drill 0.965: 0 -7.62,26.67; 1 -7.62,24.13; 2 -7.62,21.59; 3 -7.62,19.05; 3.3V 7.62,24.13; 3.3V3 -7.62,-6.35; 4 -7.62,16.51; 5 -7.62,13.97; 6 -7.62,11.43; 7 -7.62,8.89; 8 -7.62,6.35; 9 -7.62,3.81; 10 -7.62,1.27; 11 -7.62,-1.27; 12 -7.62,-3.81; 13 7.62,-3.81; 14/A0 7.62,-1.27; 15/A1 7.62,1.27; 16/A2 7.62,3.81; 17/A3 7.62,6.35; 18/A4 7.62,8.89; 19/A5 7.62,11.43; 20/A6 7.62,13.97; 21/A7 7.62,16.51; 22/A8 7.62,19.05; 23/A9 7.62,21.59; 24 -7.62,-8.89; 25 -7.62,-11.43; 26 -7.62,-13.97; 27 -7.62,-16.51; 28 -7.62,-19.05; 29 -7.62,-21.59; 30 -7.62,-24.13; 31/A12 -7.62,-26.67; 32/A13 -7.62,-29.21; 33/A14 7.62,-29.21; 34/A15 7.62,-26.67; 35/A16 7.62,-24.13; 36/A17 7.62,-21.59; 37/A18 7.62,-19.05; 38/A19 7.62,-16.51; 39/A20 7.62,-13.97; A21 7.62,-11.43; A22 7.62,-8.89; AGND 7.62,26.67; GND -7.62,29.21; GND1 7.62,-6.35; VIN 7.62,29.21 | drill 1.1 offset: USBD+ -1.27,27.94; USBD- 1.27,27.94
GH-08-V = smd 0.6 x 1.7: 1 -4.375,2.5; 2 -3.125,2.5; 3 -1.875,2.5; 4 -0.625,2.5; 5 0.625,2.5; 6 1.875,2.5; 7 3.125,2.5; 8 4.375,2.5 | smd 1 x 2.8: CASE0 6.225,-0.85; CASE1 -6.225,-0.85
P1-13 = drill 1.321 pad 2.159 octagon: TP 0,0
WIZ820 = drill 0.9 square: GND1 -10.16,0; GND3 10.16,0 | drill 0.9: GND2 -10.16,-2.54; INT -10.16,-12.7; MISO 10.16,-12.7; MOSI -10.16,-5.08; PWDN 10.16,-7.62; RESET 10.16,-10.16; SCLK -10.16,-7.62; SS -10.16,-10.16; VIN1 10.16,-2.54; VIN2 10.16,-5.08
1X03/90 = drill 1.016 long: 1 -2.54,-3.81; 2 0,-3.81; 3 2.54,-3.81

### Placement (x,y rotation side)
5V_LED  17,31.9 0 top
5V_SMOKE  86,28 0 top
12V_AX12  26,25 270 top
AX12_AR  14,14 90 top
AX12_AV  69,10 0 top
C1  69,30 0 top
C2  69,39 0 top
C3  69,45 0 top
C4  17,38 180 top
C7  7,44 90 top
C8  58,29 180 top
C9  78,27 270 top
C10  69,24 0 top
C11  17,35 180 top
C12  32,36 180 top
C13  32,39 180 top
C14  68,13 180 bottom
C15  17,13 90 bottom
D1  33,22 0 top
DC1  70,42 180 bottom
DC2  16,41 0 bottom
DC3  70,27 180 bottom
DC4  31,33 0 bottom
ENCODEUR_DROIT  99,5 180 top
ENCODEUR_GAUCHE  40,5 180 top
ENDSTOP  69,18 180 top
EXTRA  117,21 180 top
EXTRA1  115,59 270 top
FUMIGENE  99,12 180 top
JUMPER  82,5 180 top
LED1  61.5,64 0 top
LED2  93,76 0 top
LED3  109,76 180 top
LED4  101,66 180 top
LED5  101,58 180 top
LEVEL_SHIFTER1:Q1  BSS138  [SOT23]  114,44 90 top
LEVEL_SHIFTER1:R1  10k  [R0805]  117,44 90 top
LEVEL_SHIFTER1:R2  10k  [R0805]  114,41 180 top
LEVEL_SHIFTER2:Q1  BSS138  [SOT23]  8,31 180 top
LEVEL_SHIFTER2:R1  10k  [R0805]  8,34 180 top
LEVEL_SHIFTER2:R2  10k  [R0805]  8,27 90 top
LEVEL_SHIFTER3:Q1  BSS138  [SOT23]  41,20 90 top
LEVEL_SHIFTER3:R1  10k  [R0805]  44,20 90 top
LEVEL_SHIFTER3:R2  10k  [R0805]  46.6,18.6 90 top
LEVEL_SHIFTER4:Q1  BSS138  [SOT23]  90,62 0 top
LEVEL_SHIFTER4:R1  10k  [R0805]  90,59 0 top
LEVEL_SHIFTER4:R2  10k  [R0805]  90,65 180 top
LEVEL_SHIFTER5:Q1  BSS138  [SOT23]  95,62 0 top
LEVEL_SHIFTER5:R1  10k  [R0805]  95,59 0 top
LEVEL_SHIFTER5:R2  10k  [R0805]  95,65 0 top
LEVEL_SHIFTER6:Q1  BSS138  [SOT23]  91,23 90 top
LEVEL_SHIFTER6:R1  10k  [R0805]  94,23 90 top
LEVEL_SHIFTER6:R2  10k  [R0805]  88,23 270 top
LIPO  23,10 0 top
P1  29,18 270 bottom
PAS_A_PAS  56,10 180 top
PHARES_AR  40,15 180 top
PHARES_AV  14.5,25 90 top
Q1  101,18 180 top
Q2  97,18 180 top
Q3  119,25.5 180 top
Q4  115,25.5 180 top
R1  10,61 270 top
R2  101,21 180 top
R3  101,23 0 top
R4  93,73 0 top
R5  109,73 0 top
R6  97,21 180 top
R7  97,23 0 top
R8  106,66 180 top
R9  106,58 180 top
R10  119,28.5 180 top
R11  119,30.5 0 top
R12  115,28.5 180 top
R13  115,30.5 0 top
S1  50,41 270 top
S3  101,75 180 top
SJ1  31,30 180 top
TEENSY  92.5,41 270 top
TOF_AR  107,17 270 top
TOF_AV  56,18 180 top
TP1  5,28 0 top
TP2  40,23 0 top
TP3  76,10 0 top
TP4  37,28 0 top
U1  23,52 180 top
USB1  118,70 180 top
VESC  90,15 180 top

### Tracks (layer width: path | path; a pad name or v marks a point on that pad's centre or on a via)
+3V3  (via drill 0.35, 0.4)
  Top 0.3: LEVEL_SHIFTER2:Q1.1 LEVEL_SHIFTER2:R1.1 8.95,36.05 5.6,39.4 5.6,47.3 U1.VIN1 | LEVEL_SHIFTER3:Q1.1 LEVEL_SHIFTER3:R1.1 45.91,20.96 45.91,22.49 45.49,22.91 43.65,24.75 S1.VDD | LEVEL_SHIFTER5:Q1.1 LEVEL_SHIFTER5:R1.1 | LEVEL_SHIFTER5:Q1.1 92.95,62 90.15,62 LEVEL_SHIFTER4:Q1.1 LEVEL_SHIFTER4:R1.1 89.05,51.52 TEENSY.3.3V3 86.15,47.76 88.42,45.49 v88.8,45.49 | LEVEL_SHIFTER5:Q1.1 95.2,62.05 95.64,62.05 98.1,64.5 98.1,72.64 98.46,73 | S3.3 98.46,73 | R5.1 98.46,73 | TEENSY.3.3V 116.63,42.68 LEVEL_SHIFTER1:R1.1 LEVEL_SHIFTER1:Q1.1 114,44.15 114,44.8 v113.2,45.6 113.2,48.05 113.06,48.19 113.06,57.06 EXTRA1.3 | v110.6,30.8 110.8,30.6 110.8,20.8 110.12,20.12 TOF_AR.2 105.25,20.12 v104.71,19.59 | TOF_AV.2 59.12,14.88 59.8,14.2 68.4,14.2 69,14.8 | ENDSTOP.2 69,14.8 | 69,14.8 70.4,13.4 70.4,8.6 77.8,1.2 81.2,1.2 82,2 JUMPER.2 82,3 82.8,3.8 88.4,3.8 v88.8,4.2 | LEVEL_SHIFTER6:Q1.1 LEVEL_SHIFTER6:R1.1 94.8,21.25 v94.8,8.6
  Bottom 0.3: 43.4,54.9 36.31,54.9 34.95,53.54 13.84,53.54 U1.VIN1 U1.VIN2 | 43.4,54.9 84.39,54.9 84.81,54.48 86.15,53.14 TEENSY.3.3V3 | v110.6,30.8 111.6,31.8 115.2,31.8 116.63,33.23 TEENSY.3.3V | S1.VDD 43.65,39.04 39.66,43.03 39.66,48.37 43.4,52.11 43.4,54.9 | v88.8,45.49 95.7,45.49 95.91,45.28 112.88,45.28 v113.2,45.6 | v104.71,19.59 103.4,18.27 103.4,12.2 99.8,8.6 v94.8,8.6 93.4,8.6 89,4.2 v88.8,4.2
+5V/1  (via drill 0.4)
  Top 0.3: DC1.3 72,42.54 72,61.12 LED1.VCC 58.66,76.4 63.14,76.4 63.72,75.82 63.72,75.48 72.8,66.4 89.55,66.4 LEVEL_SHIFTER4:R2.1 LEVEL_SHIFTER5:R2.1 | v63.4,26.8 59.4,22.8 50.8,22.8 48.8,20.8 48.8,13.6 41.88,6.67 ENCODEUR_GAUCHE.1 41.88,1.68 41.4,1.2 37.4,1.2 | ENCODEUR_DROIT.1 100.88,3.33 100.2,4 97.98,4 97.78,4.2 96.47,4.2 96.37,4.1 94.11,4.1 79.51,18.71 | 79.51,18.71 76.7,21.51 76.7,30.84 78.2,32.35 78.96,32.35 79.6,32.99 v79.6,36.8 | LEVEL_SHIFTER1:R2.1 114.95,36.85 v115,36.8 | LEVEL_SHIFTER6:R2.1 84.75,23.95 79.51,18.71 | 37.4,1.2 23.2,1.2 19.2,5.2 19.2,9.6 18.8,10 12.6,10 8,14.6 LEVEL_SHIFTER2:R2.1 | 37.4,1.2 37.4,4.32 47.3,14.22 47.3,16.95 LEVEL_SHIFTER3:R2.1
  Top 0.8: DC1.3 77.74,36.8 v79.6,36.8
  Bottom 0.3: v63.4,26.8 63.4,29.4 66.86,32.86 66.86,36.32 DC1.3
  Bottom 0.7: EXTRA1.2 118.8,57.74 118.8,49.99 117.94,49.13 117.94,48.11 118.8,47.25 118.8,36.8
  Bottom 0.8: v79.6,36.8 v115,36.8 118.8,36.8 121.71,33.89 TEENSY.VIN
+5V/2
  Top 0.8: PHARES_AV.3 13.5,25 | 13.5,25 19,25 26.54,17.46 29.83,17.46 31,16.29 31,13 33.4,10.6 38.6,10.6 39.4,11.4 39.4,12.5 | C7.+ 12.24,42.22 DC2.3 13.46,31.9 | 13.5,25 13.46,25.04 13.46,26.2 | 13.46,31.9 13.46,30.21 13.35,30.1 13.35,28.6 13.46,28.49 13.46,26.2 | PHARES_AV.4 13.41,26.25 13.46,26.2 | PHARES_AR.4 39.4,12.5 | 39.4,12.5 PHARES_AR.3 | 5V_LED.1 13.46,31.9
+5V/3
  Bottom 0.8: FUMIGENE.VCC 94.4,16.6 84.6,16.6 75.2,26 | DC3.3 74.2,27 75.2,26 | 75.2,26 75.22,26 C9.+ 83.95,28.78 5V_SMOKE.1 85.96,26.77 85.96,26.75 86.73,25.98 87.81,25.98 89.03,27.2 108,27.2 111.4,23.8 114.2,23.8 EXTRA.VCC
+12V  (via drill 0.4)
  Top 0.8: SJ1.2 31,28.42 30,27.42 30,25 | 30,25 v30,23 | 12V_AX12.2 30,25
  Bottom 0.8: 31,7.2 66.2,7.2 AX12_AV.DYN_VCC 68.95,10.05 C14.2 | 31,7.2 27.8,7.2 25,10 20.6,10 18.8,11.8 18.8,13.2 18.05,13.95 C15.2 14.05,13.95 AX12_AR.DYN_VCC | v30,23 31,22 31,7.2
+24V
  Top 0.305: SJ1.1 33.54,30
  Top 0.8: TP4.TP 33.54,28
  Top 2.8: D1.- 33.54,25.35 33.54,28 33.54,30 DC4.1 33.54,38.86 | 33.54,38.86 C13.1 33.4,40.6 33,41 33,41.01 32.01,42 19.54,42 DC2.1 18.44,40.9 18.44,39.99 18.4,39.95 C4.1 C11.1 | C12.1 33.4,38.72 | 33.4,38.72 33.54,38.86 | C10.1 67.46,24.14 DC3.1 67.46,29.86 C1.1 67.6,29.6 67,29 C8.+ 59.78,33.76 S1.VMOT 59,34.76 59,38 | C3.1 67.6,43.05 67.56,43.01 67.56,42.1 DC1.1 67.56,41.9 67.56,40.99 67.6,40.95 C2.1 66.6,38 59,38 | 59,38 34.12,38 33.4,38.72
CHOOSE_COLOR
  Top 0.3: R4.2 97.8,76.85 101,76.85 | 101,76.85 106.73,76.85 LED3.C 108.83,77.25 111.37,77.25 111.6,77.02 111.6,72.75 110.64,71.8 100.2,71.8 98.6,70.2 98.6,48.87 TEENSY.8 | S3.2 101,76.85
CMD_DEL_AR  (via drill 0.4)
  Top 0.3: LEVEL_SHIFTER3:Q1.2 LEVEL_SHIFTER3:R1.2 45.2,22.15 v45.2,22.2
  Bottom 0.3: v45.2,22.2 45.2,38.2 40.16,43.24 40.16,48.16 43.4,51.4 81.4,51.4 83.15,49.65 84.04,49.65 84.64,49.05 84.64,48.16 86.1,46.7 100.93,46.7 102.85,48.62 TEENSY.6
CMD_DEL_AR_5V
  Top 0.3: PHARES_AR.5 37.5,14.1 39.9,16.5 39.9,18 | 39.9,18 LEVEL_SHIFTER3:Q1.3 40,20.1 TP2.TP | LEVEL_SHIFTER3:R2.2 45.05,18 39.9,18
CMD_DEL_AV  (via drill 0.4)
  Top 0.3: LEVEL_SHIFTER2:Q1.2 LEVEL_SHIFTER2:R1.2 7.05,37.24 5.1,39.19 5.1,47.51 11.84,54.25 11.84,54.95 12.49,55.6 35.19,55.6 v35.6,55.19
  Bottom 0.3: v35.6,55.19 35.81,55.4 84.6,55.4 85.02,54.98 87.4,52.6 87.4,48.45 88.65,47.2 99.97,47.2 TEENSY.7
CMD_DEL_AV_5V
  Top 0.3: PHARES_AV.5 8.45,27.5 LEVEL_SHIFTER2:R2.2 | LEVEL_SHIFTER2:R2.2 LEVEL_SHIFTER2:Q1.3 | LEVEL_SHIFTER2:R2.2 7.95,28 TP1.TP
CMD_FUM_POMPE
  Top 0.3: TEENSY.20/A6 105.09,32 101,32 100.05,31.05 R3.1
CMD_FUM_RES
  Top 0.3: TEENSY.17/A3 96.05,30.58 R7.1
DEL_ERROR
  Top 0.3: TEENSY.4 109.01,63.94 R8.1
DEL_WARNING
  Top 0.3: TEENSY.5 106.47,57.52 R9.1
DIR
  Bottom 0.3: TEENSY.29 68.63,50.9 44.66,50.9 S1.DIR
ENC_D_A
  Top 0.3: TEENSY.39/A20 76.2,31.05 76.2,21.31 93.91,3.6 96.58,3.6 96.68,3.7 97.57,3.7 98.38,2.9 ENCODEUR_DROIT.3
ENC_D_B
  Top 0.3: ENCODEUR_DROIT.4 94.3,2.5 75.7,21.1 75.7,33.09 TEENSY.38/A19
ENC_G_A  (via drill 0.4)
  Top 0.3: ENCODEUR_GAUCHE.3 39.38,4.88 48.3,13.81 48.3,21.01 50.59,23.3 58.9,23.3 v62.4,26.8
  Bottom 0.3: v62.4,26.8 62.4,29.95 TEENSY.34/A15
ENC_G_B  (via drill 0.4)
  Top 0.3: ENCODEUR_GAUCHE.4 38.12,4.34 47.8,14.01 47.8,21.21 50.39,23.8 58.39,23.8 v61.4,26.8
  Bottom 0.3: v61.4,26.8 61.4,31.49 TEENSY.33/A14
ENDSTOP  (via drill 0.4)
  Top 0.3: ENDSTOP.3 67.75,17.15 74.7,24.1 74.7,31.13 v74.49,31.34 | v96.2,45.99 96.31,46.1 TEENSY.9
  Bottom 0.3: v74.49,31.34 74.49,40.63 80.06,46.2 95.99,46.2 v96.2,45.99
ETH_MISO
  Bottom 0.3: TEENSY.12 88.69,54.91 87.2,56.4 33.89,56.4 33.57,56.08 32.32,56.08 23.7,64.7 U1.MISO
ETH_MOSI
  Bottom 0.3: TEENSY.11 91.23,55.26 89.59,56.9 33.34,56.9 U1.MOSI
ETH_RST  (via drill 0.4)
  Top 0.2: 85.2,48 85.17,48.03 85.17,49.57 85.2,49.6
  Top 0.3: U1.RESET 10.21,62.16 R1.1 | TEENSY.15/A1 89.19,37.96 89.19,44.01 85.2,48 | 85.2,49.6 85.2,55.58 v85.31,55.69
  Bottom 0.3: U1.RESET 25.53,62.16 32.11,55.58 33.78,55.58 34.1,55.9 85.1,55.9 v85.31,55.69
ETH_SCLK  (via drill 0.4)
  Top 0.2: 84.6,48 84.6,49.6
  Top 0.3: 84.6,48 84.6,47.89 88.69,43.8 TEENSY.13 | 84.6,49.6 84.6,57.21 v84.2,57.61
  Bottom 0.3: v84.2,57.61 83.99,57.4 35.38,57.4 U1.SCLK
ETH_SS
  Bottom 0.3: TEENSY.10 93.77,53.43 89.8,57.4 85.41,57.4 84.49,58.32 83.91,58.32 83.49,57.9 37.42,57.9 U1.SS
EXTRA_GPIO_1  (via drill 0.4)
  Top 0.3: EXTRA1.4 115,56.12 116.77,54.36 116.77,51.3 TEENSY.2 | v117.89,37.76 117.89,30.66 R11.1
  Bottom 0.3: TEENSY.2 115.31,47.4 117.66,47.4 118.1,46.96 118.1,37.97 v117.89,37.76
EXTRA_GPIO_2  (via drill 0.4)
  Top 0.3: R13.1 114.05,31.65 115.12,32.72 115.12,33.88 114,35 v114,37.8
  Bottom 0.3: EXTRA1.5 115,52.07 TEENSY.3 114,46.17 v114,37.8
EXTRA_POWER_SWITCH_1
  Top 0.8: Q3.3 EXTRA.GND
EXTRA_POWER_SWITCH_2
  Top 0.8: Q4.3 EXTRA.DATA
FUM_POMPE
  Top 0.8: FUMIGENE.GND Q1.3
FUM_RES
  Top 0.8: FUMIGENE.DATA Q2.3
GND  (via drill 0.4, 2.2)
  Top 2.8: LIPO.(-) 23,18
  Bottom 2.8: LIPO.(-) 23,17
  other vias: 99,16.7 109,28 73,24 74,16 64,13 75,19 79,15 81,23 84,20 75,45 79,43 38,45 42,45 40,41 44,41 20,22 22,20 22,24 24,22 33,9 35,5 47,5 47,9 41,9 34,12 32,18 27,19 24,40 26,40 24,44 26,44 71,59 71,60 73,60 73,59 40.6,4.4 3.5,75 119.5,75 2.5,11 120.5,11 107.6,26 117,24.4
  pour Top: 0,78 123,78 123,4 123,0 103,0 0,0
  pour Bottom: 0,78 123,78 123,0 0,0
JUMPER
  Top 0.3: JUMPER.3 80.75,15.25 75.2,20.8 75.2,31.63 TEENSY.37/A18
N$1
  Top 0.3: LED4.A R8.2
N$2
  Bottom 0.8: S1.1B 46.19,26.81 53,20 53,15.6 PAS_A_PAS.2
N$3
  Bottom 0.8: S1.1A 48.73,26.27 55,20 PAS_A_PAS.3
N$4
  Top 0.3: 34.04,20.85 D1.+2 D1.+1
  Top 2.8: P1.P$1 29.31,20.85 34.04,20.85
N$5
  Bottom 0.8: S1.2A 51.27,25.73 57,20 PAS_A_PAS.4
N$6
  Bottom 0.8: S1.2B 53.81,25.19 59,20 PAS_A_PAS.5
N$7
  Top 0.3: R4.1 92.05,75.53 LED2.A
N$8
  Top 0.3: LED3.A 109.95,75.53 R5.2
N$9
  Top 0.3: R11.2 R10.1 Q3.1
N$10
  Top 0.3: Q1.1 R2.1 R3.2
N$11
  Top 0.3: LED5.A R9.2
N$12
  Top 0.3: R13.2 R12.1 Q4.1
N$13
  Top 0.3: Q2.1 R6.1 R7.2
REG_12V
  Top 0.8: SJ1.3 29.48,31.98 DC4.3 | SJ1.3 31,30 | SJ1.3 27.02,27.54 12V_AX12.1
S_MS1
  Bottom 0.3: TEENSY.28 72.23,47.4 60.18,47.4 59.28,48.3 57.3,48.3 S1.MS1
S_MS2
  Bottom 0.3: TEENSY.27 74.27,46.9 59.78,46.9 59.28,46.4 54.76,46.4 S1.MS2
S_MS3
  Bottom 0.3: TEENSY.26 76.31,46.4 59.99,46.4 59.49,45.9 52.72,45.9 S1.MS3
S_N_RST
  Bottom 0.3: S1.N_RST 50.78,49.4 62.51,49.4 TEENSY.32/A13
S_N_SLEEP
  Bottom 0.3: TEENSY.31/A12 64.55,49.9 48.74,49.9 S1.N_SLEEP
SCL  (via drill 0.4)
  Top 0.3: LEVEL_SHIFTER5:Q1.2 LEVEL_SHIFTER5:R1.2 97.6,57.35 97.6,39.71 TEENSY.19/A5 | TOF_AR.4 104.81,17.62 103.5,18.94 103.5,31.19 v103.6,31.29 102.69,31.29 v102,30.6 | TOF_AV.4 56.62,19.62 57.3,20.3 60.73,20.3 60.88,20.44 60.88,20.6 61.37,21.1 61.53,21.1 63.43,23 v64.6,23
  Bottom 0.3: v103.6,31.29 103.93,31.62 TEENSY.19/A5 | v64.6,23 64.85,23.25 65.39,23.25 68.81,26.67 68.81,27.49 71.92,30.6 98.38,30.6 99.09,29.89 100.51,29.89 101.29,29.89 v102,30.6
SCL_5V
  Top 0.3: LEVEL_SHIFTER5:Q1.3 95.95,64.05 LEVEL_SHIFTER5:R2.2 93.75,67.2 73.54,67.2 LED1.SCL
SDA  (via drill 0.4)
  Top 0.3: LEVEL_SHIFTER4:Q1.2 LEVEL_SHIFTER4:R1.2 95.2,54.75 95.2,39.57 TEENSY.18/A4 | TOF_AR.3 104.33,18.88 104,19.2 104,30.39 v104.21,30.6 | TOF_AV.3 57.88,19.27 58.4,19.8 61,19.8 61.38,20.18 61.38,20.39 61.58,20.6 61.8,20.6 63.2,22 v64.6,22
  Bottom 0.3: TEENSY.18/A4 102.89,31.88 102.89,30.6 | 102.89,30.6 102.89,30.49 101.79,29.39 98.89,29.39 98.18,30.1 72.7,30.1 71.19,28.59 71.19,26.51 66.97,22.29 64.89,22.29 v64.6,22 | v104.21,30.6 103.91,30.6 103.89,30.58 102.91,30.58 102.89,30.6
SDA_5V
  Top 0.3: LEVEL_SHIFTER4:Q1.3 89.05,64.05 LEVEL_SHIFTER4:R2.2 73.2,65 LED1.SDA
SERIAL_AX12
  Top 0.3: TEENSY.0 TEENSY.1 116.63,45.32 LEVEL_SHIFTER1:R1.2 LEVEL_SHIFTER1:Q1.2
SERIAL_AX12_5V  (via drill 0.4)
  Top 0.3: LEVEL_SHIFTER1:Q1.3 112.9,41.15 LEVEL_SHIFTER1:R2.2 107.8,35.75 107.8,28.49 v104.71,25.4
  Bottom 0.3: AX12_AV.DATA 67.99,6.45 27.81,6.45 24.39,3.02 21.61,3.02 19.65,4.99 19.65,9.89 19.14,10.4 12.88,10.4 12.25,11.03 12.25,14.79 AX12_AR.DATA | AX12_AV.DATA 100.49,10 102.9,12.41 102.9,18.78 104.71,20.59 v104.71,25.4 | TP3.TP AX12_AV.DATA
STEP
  Bottom 0.3: TEENSY.30 66.59,50.4 46.7,50.4 S1.STEP
TOF_AR_D
  Top 0.3: TOF_AR.7 110.08,13.88 111.8,15.6 111.8,19.68 112.31,20.19 112.31,31.6 TEENSY.23/A9
TOF_AR_FD  (via drill 0.4)
  Top 0.3: TOF_AR.8 108.9,13.22 108.5,13.22 103,18.73 103,24 100.76,26.24 v100.76,30.76
  Bottom 0.3: v100.76,30.76 98.93,30.76 TEENSY.16/A2
TOF_AR_FG
  Top 0.3: TOF_AR.5 110.38,16.38 110.8,16.8 110.8,20.09 111.31,20.6 111.31,31.09 110.89,31.51 110.88,31.51 TEENSY.21/A7
TOF_AR_G
  Top 0.3: TOF_AR.6 110.12,15.12 111.3,16.3 111.3,19.89 111.81,20.4 111.81,31.3 111.3,31.81 111.3,33.13 TEENSY.22/A8
TOF_AV_D  (via drill 0.4)
  Top 0.3: TOF_AV.8 51.62,18.23 55.7,22.3 59.74,22.3 60.54,23.1 60.7,23.1 64.11,26.51 v64.4,26.8
  Bottom 0.3: v64.4,26.8 64.4,29.41 TEENSY.35/A16
TOF_AV_G  (via drill 0.4)
  Top 0.3: TOF_AV.5 55.38,19.85 56.32,20.8 60.37,20.8 61.17,21.6 61.33,21.6 63.68,23.96 v64.6,23.96
  Bottom 0.2: 72.4,32.6 72.4,34
  Bottom 0.3: v64.6,23.96 64.81,24.17 64.89,24.17 66.2,25.47 66.2,28.39 69.01,31.2 70.14,31.2 70.79,31.85 71.65,31.85 72.4,32.6 | 72.4,34 72.4,39.24 80.75,47.59 81.5,47.59 82.53,48.62 TEENSY.24
TOF_AV_SD  (via drill 0.4)
  Top 0.3: TOF_AV.7 52.88,18.77 55.91,21.8 59.95,21.8 60.75,22.6 60.91,22.6 64.11,25.8 v64.6,25.8
  Bottom 0.3: TEENSY.36/A17 69.73,32.2 68.6,32.2 65.2,28.8 65.2,26.39 v64.6,25.8
TOF_AV_SG  (via drill 0.4)
  Top 0.3: TOF_AV.6 54.12,19.31 56.11,21.3 60.16,21.3 60.96,22.1 61.12,22.1 63.89,24.88 v64.6,24.88
  Bottom 0.2: 71.8,34 71.8,33.88 71.89,33.79 71.89,32.9 71.34,32.35
  Bottom 0.3: 71.34,32.35 70.58,32.35 69.94,31.7 68.81,31.7 65.7,28.59 65.7,25.89 64.9,25.09 64.81,25.09 v64.6,24.88 | 71.8,34 71.8,39.35 TEENSY.25
USB_D+
  Top 0.2: TEENSY.USBD+ 120.6,42.43 120.6,67 arc-90 120.95,67.35 122.25,67.35 arc90 122.6,67.7 122.6,67.75 arc90 122.25,68.1 120.95,68.1 arc-90 120.6,68.45 120.6,69.94 USB1.1
USB_D-
  Top 0.2: USB1.2 120.2,67.8 120.2,43.52 119.39,42.7 119.39,41.84 120.44,40.78 TEENSY.USBD-
V_LIPO
  Top 2.8: LIPO.(+) 29,12.38 P1.P$2
VESC_CMD
  Top 0.3: LEVEL_SHIFTER6:R1.2 LEVEL_SHIFTER6:Q1.2 92.2,24.05 92.2,32.41 TEENSY.14/A0
VESC_CMD_5V
  Top 0.3: LEVEL_SHIFTER6:Q1.3 88.95,22.05 LEVEL_SHIFTER6:R2.2 89.3,22.05 VESC.1

### Text on the board
tPlace: USB | error | GND | 5V | 3.3V | pin2 | warning | pin3 | © 2019 - GobGob Senpaï | Teensy 3.5 | 5V | 5V-EXT | 12V | 24V | DATA F-LED | FRONT LED | DATA R-LED | FRONT TOF | ENDSTOP | EXTRA | REAR TOF | VESC | AX12 | SMOKE | STEPPER | AX12 | REAR LED | DATA AX12 | ENCODER | JUMPER | ENCODER